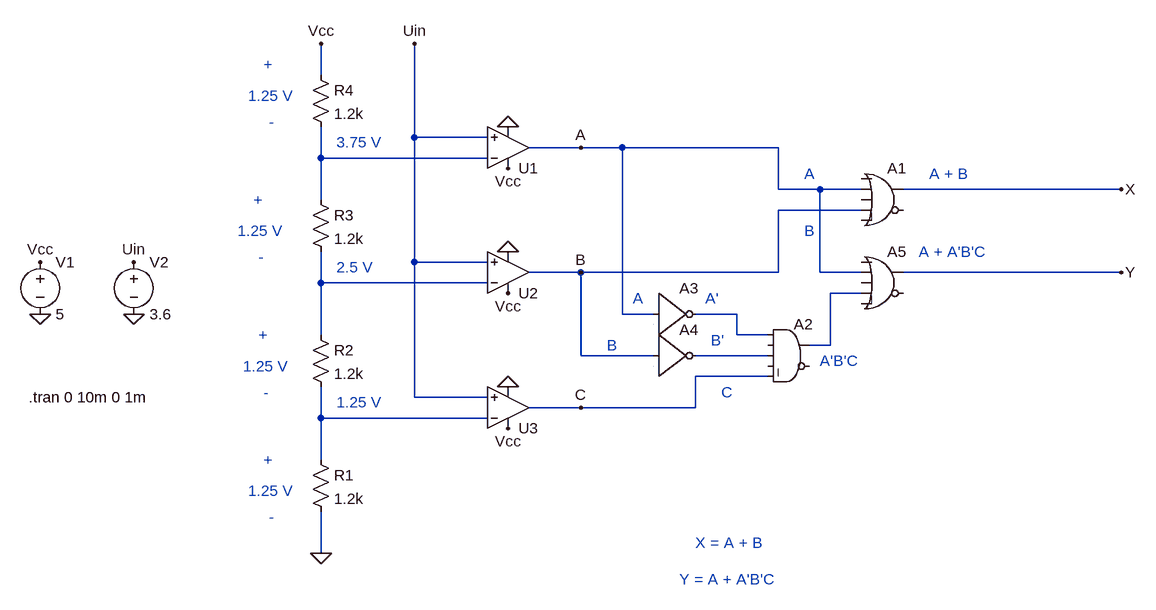
[diagram p0: schematic 2-bit ADC.asc]
2-bit ADC.asc, the LTspice schematic file:
Version 4
SHEET 1 1808 680
WIRE 544 -176 544 -224
WIRE 688 -80 688 -224
WIRE 800 -80 688 -80
WIRE 944 -64 864 -64
WIRE 1008 -64 944 -64
WIRE 1248 -64 1008 -64
WIRE 544 -48 544 -96
WIRE 800 -48 544 -48
WIRE 1248 0 1248 -64
WIRE 1312 0 1248 0
WIRE 1376 0 1312 0
WIRE 1776 0 1440 0
WIRE 544 16 544 -48
WIRE 1376 32 1248 32
WIRE 688 112 688 -80
WIRE 800 112 688 112
WIRE 944 128 864 128
WIRE 1248 128 1248 32
WIRE 1248 128 944 128
WIRE 1312 128 1312 0
WIRE 1376 128 1312 128
WIRE 1776 128 1440 128
WIRE 544 144 544 96
WIRE 800 144 544 144
WIRE 1376 160 1328 160
WIRE 1008 192 1008 -64
WIRE 1056 192 1008 192
WIRE 1184 192 1120 192
WIRE 544 224 544 144
WIRE 1184 224 1184 192
WIRE 1232 224 1184 224
WIRE 1328 240 1328 160
WIRE 1328 240 1296 240
WIRE 944 256 944 128
WIRE 1056 256 944 256
WIRE 1232 256 1120 256
WIRE 1232 288 1120 288
WIRE 688 320 688 112
WIRE 800 320 688 320
WIRE 944 336 864 336
WIRE 1120 336 1120 288
WIRE 1120 336 944 336
WIRE 544 352 544 304
WIRE 800 352 544 352
WIRE 544 416 544 352
WIRE 544 560 544 496
FLAG 256 192 0
FLAG 112 192 0
FLAG 112 112 Vcc
FLAG 256 112 Uin
FLAG 544 560 0
FLAG 544 -224 Vcc
FLAG 832 -32 Vcc
FLAG 832 160 Vcc
FLAG 832 368 Vcc
FLAG 832 -96 0
FLAG 832 96 0
FLAG 832 304 0
FLAG 688 -224 Uin
FLAG 944 -64 A
FLAG 944 128 B
FLAG 944 336 C
FLAG 1776 0 X
FLAG 1776 128 Y
SYMBOL voltage 112 96 R0
WINDOW 123 0 0 Left 0
WINDOW 39 0 0 Left 0
SYMATTR InstName V1
SYMATTR Value 5
SYMBOL voltage 256 96 R0
WINDOW 123 0 0 Left 0
WINDOW 39 0 0 Left 0
SYMATTR InstName V2
SYMATTR Value 3.6
SYMBOL res 528 400 R0
SYMATTR InstName R1
SYMATTR Value 1.2k
SYMBOL res 528 208 R0
SYMATTR InstName R2
SYMATTR Value 1.2k
SYMBOL res 528 0 R0
SYMATTR InstName R3
SYMATTR Value 1.2k
SYMBOL res 528 -192 R0
SYMATTR InstName R4
SYMATTR Value 1.2k
SYMBOL OpAmps\\UniversalOpamp2 832 -64 M180
SYMATTR InstName U1
SYMBOL OpAmps\\UniversalOpamp2 832 128 M180
SYMATTR InstName U2
SYMBOL OpAmps\\UniversalOpamp2 832 336 M180
SYMATTR InstName U3
SYMBOL Digital\\or 1408 -48 R0
SYMATTR InstName A1
SYMATTR SpiceLine VHIGH=5V
SYMBOL Digital\\and 1264 192 R0
SYMATTR InstName A2
SYMATTR SpiceLine VHIGH=5V
SYMBOL Digital\\inv 1056 128 R0
SYMATTR InstName A3
SYMATTR SpiceLine VHIGH=5V
SYMBOL Digital\\inv 1056 192 R0
SYMATTR InstName A4
SYMATTR SpiceLine VHIGH=5V
SYMBOL Digital\\or 1408 80 R0
SYMATTR InstName A5
SYMATTR SpiceLine VHIGH=5V
TEXT 94 320 Left 2 !.tran 0 10m 0 1m
TEXT 432 -144 Left 2 ;1.25 V
TEXT 456 -192 Left 2 ;+
TEXT 464 -104 Left 2 ;-
TEXT 416 64 Left 2 ;1.25 V
TEXT 440 16 Left 2 ;+
TEXT 448 104 Left 2 ;-
TEXT 424 272 Left 2 ;1.25 V
TEXT 448 224 Left 2 ;+
TEXT 456 312 Left 2 ;-
TEXT 432 464 Left 2 ;1.25 V
TEXT 456 416 Left 2 ;+
TEXT 464 504 Left 2 ;-
TEXT 568 -72 Left 2 ;3.75 V
TEXT 568 120 Left 2 ;2.5 V
TEXT 568 328 Left 2 ;1.25 V
TEXT 1120 544 Left 2 ;X = A + B
TEXT 1096 600 Left 2 ;Y = A + A'B'C
TEXT 1288 -24 Left 2 ;A
TEXT 1288 64 Left 2 ;B
TEXT 1480 -24 Left 2 ;A + B
TEXT 1024 168 Left 2 ;A
TEXT 1136 168 Left 2 ;A'
TEXT 984 240 Left 2 ;B
TEXT 1144 232 Left 2 ;B'
TEXT 1160 312 Left 2 ;C
TEXT 1312 264 Left 2 ;A'B'C
TEXT 1464 96 Left 2 ;A + A'B'C

The netlist it stands for:
* 2-bit ADC.asc
V1 Vcc 0 5
V2 Uin 0 3.6
R1 N006 0 1.2k
R2 N002 N006 1.2k
R3 N001 N002 1.2k
R4 Vcc N001 1.2k
XU1 Uin N001 Vcc 0 A level.2 Avol=1Meg GBW=10Meg Slew=10Meg ilimit=25m rail=0 Vos=0 phimargin=45 en=0 enk=0 in=0 ink=0 Rin=500Meg  ; pins IN+ IN- V+ V- OUT
XU2 Uin N002 Vcc 0 B level.2 Avol=1Meg GBW=10Meg Slew=10Meg ilimit=25m rail=0 Vos=0 phimargin=45 en=0 enk=0 in=0 ink=0 Rin=500Meg  ; pins IN+ IN- V+ V- OUT
XU3 Uin N006 Vcc 0 C level.2 Avol=1Meg GBW=10Meg Slew=10Meg ilimit=25m rail=0 Vos=0 phimargin=45 en=0 enk=0 in=0 ink=0 Rin=500Meg  ; pins IN+ IN- V+ V- OUT
A1 0 A 0 B 0 0 X 0 OR VHIGH=5V
A2 N004 0 N005 0 C 0 N003 0 AND VHIGH=5V
A3 A 0 0 0 0 N004 0 0 BUF VHIGH=5V
A4 B 0 0 0 0 N005 0 0 BUF VHIGH=5V
A5 0 A 0 N003 0 0 Y 0 OR VHIGH=5V
.tran 0 10m 0 1m
* 1.25 V
* +
* -
* 1.25 V
* +
* -
* 1.25 V
* +
* -
* 1.25 V
* +
* -
* 3.75 V
* 2.5 V
* 1.25 V
* X = A + B
* Y = A + A'B'C
* A
* B
* A + B
* A
* A'
* B
* B'
* C
* A'B'C
* A + A'B'C
.lib UniversalOpamps2.sub
.backanno
.end